# Altium schematic sheet RF frontend.SchDoc
size A3; SheetNumber: 2; SheetTotal: 3
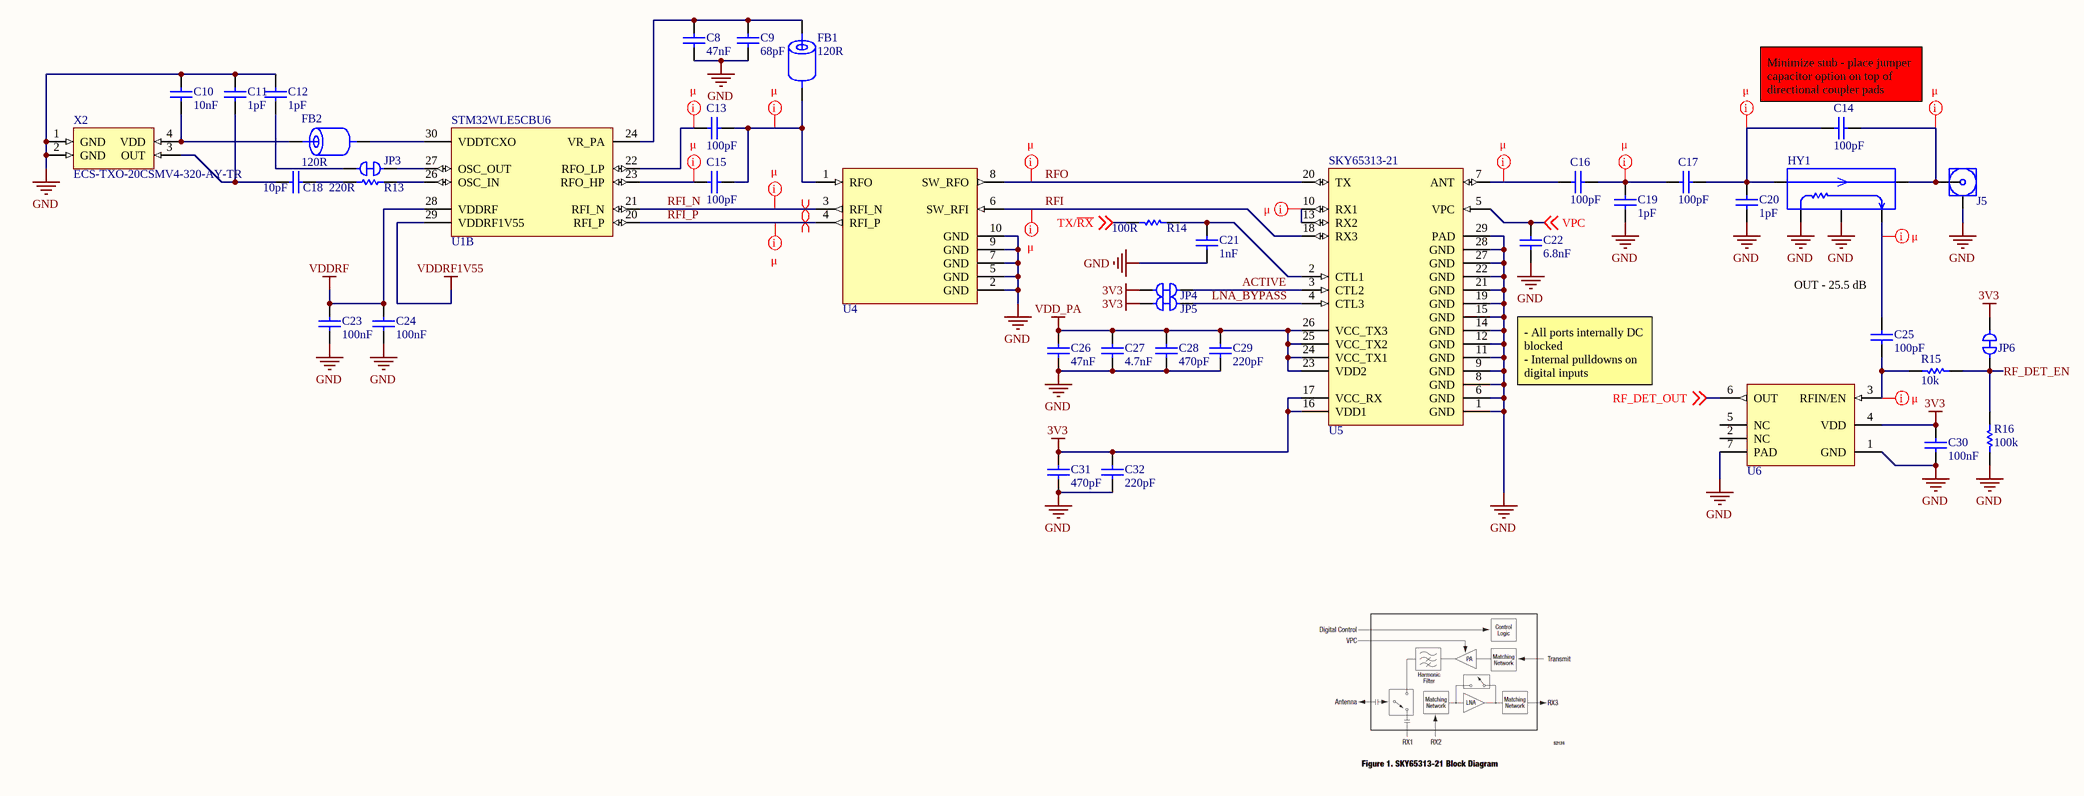
[diagram p0: RF frontend.SchDoc]

## Parts
C8  value 47nF  [CAPC1608X10N]  (hidden comment: CL10B473KB8NNNC)
C9  value 68pF  [CAPC1005X06N]  (hidden comment: CL05C680JB5NNNC)
C10  value 10nF  [CAPC1608X10N]  (hidden comment: C0603C103J5RACTU)
C11  value 1pF  [CAPC1608X10N]  (hidden comment: CC0603CRNPO0BN1R0)
C12  value 1pF  [CAPC1608X10N]  (hidden comment: CC0603CRNPO0BN1R0)
C13  value 100pF  [CAPC1005X05N]  (hidden comment: C0402C101J5GAC7411)
C14  value 100pF  [CAPC1005X05N]  (hidden comment: C0402C101J5GAC7411)
C15  value 100pF  [CAPC1005X05N]  (hidden comment: C0402C101J5GAC7411)
C16  value 100pF  [CAPC1005X05N]  (hidden comment: C0402C101J5GAC7411)
C17  value 100pF  [CAPC1005X05N]  (hidden comment: C0402C101J5GAC7411)
C18  value 10pF  [CAPC1608X10N]  (hidden comment: GRM1885C1H100JA01D)
C19  value 1pF  [CAPC1005X05N]  (hidden comment: GCM1555C1H1R0JA16D)
C20  value 1pF  [CAPC1005X05N]  (hidden comment: GCM1555C1H1R0JA16D)
C21  value 1nF  [CAPC1608X10N]  (hidden comment: C0603C102K5RAC)
C22  value 6.8nF  [CAPC1005X06N]  (hidden comment: 0402B682K500NT)
C23  value 100nF  [CAPC1608X10N]  (hidden comment: C0603C104M5RACTU)
C24  value 100nF  [CAPC1608X10N]  (hidden comment: C0603C104M5RACTU)
C25  value 100pF  [CAPC1005X05N]  (hidden comment: C0402C101J5GAC7411)
C26  value 47nF  [CAPC1608X10N]  (hidden comment: CL10B473KB8NNNC)
C27  value 4.7nF  [CAPC1608X10N]  (hidden comment: 0603B472K500NT)
C28  value 470pF  [CAPC1608X10N]  (hidden comment: C0603C471J1RACTU)
C29  value 220pF  [CAPC1608X10N]  (hidden comment: CL10B221KB8NNNC)
C30  value 100nF  [CAPC1608X10N]  (hidden comment: C0603C104M5RACTU)
C31  value 470pF  [CAPC1608X10N]  (hidden comment: C0603C471J1RACTU)
C32  value 220pF  [CAPC1608X10N]  (hidden comment: CL10B221KB8NNNC)
FB1  value 120R  [INDC1608X10N]  (hidden comment: PE-0603PFB121ST)
FB2  value 120R  [INDC1608X10N]  (hidden comment: PE-0603PFB121ST)
HY1  HHM22139A2  [SOTFL55P150X70-6N]  (value not drawn)
J5  EMPCB.SMAFSTJ.B.HT  [FP-EMPCB_SMAFSTJ_B_HT-MFG]  (value not drawn)
JP3  RC0603FR-070RL  [RESC1608X05N]  (value not drawn)
JP4  RC0603FR-070RL  [RESC1608X05N]  (value not drawn)
JP5  RC0603FR-070RL  [RESC1608X05N]  (value not drawn)
JP6  RC0603FR-070RL  [RESC1608X05N]  (value not drawn)
R13  value 220R  [RESC1005X04N]  (hidden comment: 0402WGF2200TCE)
R14  value 100R  [RESC1608X06N]  (hidden comment: CRCW0603100RFKEAC)
R15  value 10k  [RESC1608X06N]  (hidden comment: CRCW060310K0FKEA)
R16  value 100k  [RESC1608X05N]  (hidden comment: RC0603FR-07100KL)
U1  STM32WLE5CBU6  [QFN50P700X700X60_HS-49L]  (part B of 3)
U4  0900FM15K0039001E  [0900FM15K0039001E-Footprint-1]  (value not drawn)
U5  SKY65313-21  [QFN75P600X600X100_HS-25N]
U6  LMV228SD/NOPB  [NGF0006A_V]  (value not drawn)
X2  ECS-TXO-20CSMV4-320-AY-TR  [ECS-TXO-20CSMV4-320-AY-TR-Footprint-1]

## Nets
3V3: C30.2 C31.2 C32.2 JP4.1 JP5.1 JP6.2 U5.16(VDD1) U5.17(VCC_RX) U6.4(VDD)
GND: C8.1 C9.1 C10.2 C11.1 C12.1 C19.1 C20.1 C21.1 C22.1 C23.1 C24.1 C26.2 C27.2 C28.2 C29.2 C30.1 C31.1 C32.1 HY1.4(ISOLATED) HY1.5(GND) J5.2(GND) R16.1 U4.2(GND) U4.5(GND) U4.7(GND) U4.9(GND) U4.10(GND) U5.1(GND) U5.6(GND) U5.8(GND) U5.9(GND) U5.11(GND) U5.12(GND) U5.14(GND) U5.15(GND) U5.19(GND) U5.21(GND) U5.22(GND) U5.27(GND) U5.28(GND) U5.29(PAD) U6.1(GND) U6.7(PAD) X2.1(GND) X2.2(GND)
VDD_PA: C26.1 C27.1 C28.1 C29.1 U5.23(VDD2) U5.24(VCC_TX1) U5.25(VCC_TX2) U5.26(VCC_TX3)
VDDRF: C23.2 C24.2 U1.28(VDDRF)
VDDRF1V55: U1.29(VDDRF1V55)
ACTIVE: JP4.2 U5.3(CTL2)
LNA_BYPASS: JP5.2 U5.4(CTL3)
RF_DET_EN: JP6.1 R15.2 R16.2
RF_DET_OUT: U6.6(OUT) ; off-sheet RF_DET_OUT
RFI: U4.6(SW_RFI) U5.18(RX3)
RFI_N: U1.21(RFI_N) U4.3(RFI_N)
RFI_P: U1.20(RFI_P) U4.4(RFI_P)
RFO: U4.8(SW_RFO) U5.20(TX)
TX/~{RX}: R14.1 ; off-sheet TX/~{RX}
VPC: C22.2 U5.5(VPC) ; off-sheet VPC
NetC8_2: C8.2 C9.2 FB1.1 U1.24(VR_PA)
NetC10_1: C10.1 FB2.1 X2.4(VDD)
NetC11_2: C11.2 C18.1 X2.3(OUT)
NetC12_2: C12.2 JP3.2
NetC13_1: C13.1 C15.1 FB1.2 U4.1(RFO)
NetC13_2: C13.2 U1.22(RFO_LP)
NetC14_1: C14.1 HY1.2(TRANSMITTED) J5.1(SIG)
NetC14_2: C14.2 C17.1 C20.2 HY1.1(INPUT)
NetC15_2: C15.2 U1.23(RFO_HP)
NetC16_1: C16.1 C17.2 C19.2
NetC16_2: C16.2 U5.7(ANT)
NetC18_2: C18.2 R13.2
NetC21_2: C21.2 R14.2 U5.2(CTL1)
NetC25_1: C25.1 HY1.3(COUPLED)
NetC25_2: C25.2 R15.1 U6.3(RFIN/EN)
NetFB2_2: FB2.2 U1.30(VDDTCXO)
NetJP3_1: JP3.1 U1.27(OSC_OUT)
NetR13_1: R13.1 U1.26(OSC_IN)
NetU5_10: U5.10(RX1) U5.13(RX2)

Not connected (* = marked no-connect by the designer): U6 2(NC) 5(NC)

## Layout directives
net class microwave: NetC13_1, NetC13_2, NetC14_1, NetC14_2, NetC15_2, NetC16_1, NetC16_2, NetC25_1, NetC25_2, NetU5_10, RFI, RFI_N, RFI_P, RFO
differential pair: RFI_N, RFI_P

## Notes on the sheet
- (near C14) Minimize stub - place jumper capacitor option on top of directional coupler pads
- OUT - 25.5 dB
- - All ports internally DC blocked
  - Internal pulldowns on digital inputs
- Title:
- Designer:
- Date:
- Size:
- Revision:
- A3
- Sheet:
- !
- UWA Aerospace, 35 Stirling Hwy, Perth WA 6009, Australia

## Library data of the parts
C8 C26 = CMP-00130-2: Prices include import duty and tax. CAP, 0.047UF, 50V, MLCC, 0603; SVHC: No SVHC (15-Jan-2019); Material: Ceramic; Dielectric: Y5V; Tolerance: 10%; Case/Package: 0603; Radiation Hardening: No; Series: CL; Construction: Flat; Case Code (Metric): 1608; Voltage: 50V; Voltage Rating: 50V; Lead Free: Lead Free; Mounting Technology: Surface Mount; JLC_PN: C1622; Packaging: Tape and Reel; Length: 1.6mm; Depth: 0.8mm; Thickness: 0.035inch; Width: 0.031inch; Max Operating Temperature: 125°C; Package Quantity: 1; Min Operating Temperature: -55°C; Height: 0.8mm; RoHS Compliant: Yes; Case Code (Imperial): 0603; Voltage Rating (DC): 50V
C9 = CMP-00621-1: Ceramic capacitor SMD-0402 68pF /50V C0G# J +-5%, Samsung, RoHS; Voltage: 50V; Temperature Coefficient: 300ppm/°C; Dielectric: C0G; Tolerance: 5%; JLC_PN: C14441; Case/Package: 0402; Length: 1mm; Construction: Flat; Series: CL; Case Code (Imperial): 0402; Voltage Rating: 50V; Max Operating Temperature: 125°C; Min Operating Temperature: -55°C; Case Code (Metric): 1005; Height: 0.5mm; Radiation Hardening: No; Material: Ceramic; RoHS Compliant: Yes; Packaging: Tape and Reel; Lead Free: Lead Free; Voltage Rating (DC): 50V; Depth: 0.5mm; Mounting Technology: Surface Mount
C10 = CMP-00047-2: Cap Ceramic 0.01uF 50V X7R 5% SMD 0603 125C Paper T/R; Packaging: Tape and Reel; Min Operating Temperature: -55°C; Radiation Hardening: No; JLC_PN: C57112; Length: 1.6mm; Capacitance: 10nF; Depth: 0.8mm; Tolerance: 5%; Max Operating Temperature: 125°C; Case/Package: 0603; Height: 0.8mm; Dielectric: X7R; Mount: Surface Mount
C11 C12 = CMP-00536-1: 0603 1 pF 100 V ±0.25 pF Tolerance NP0 SMT Multilayer Ceramic Capacitor; Voltage Rating: 100V; Dielectric: C0G; Length: 0.063inch; Min Operating Temperature: -55°C; Lead Free: Lead Free; Mounting Technology: Surface Mount; Case/Package: 0603; Depth: 0.8mm; Width: 0.031inch; Height: 0.8mm; Case Code (Imperial): 0603; Weight: 7.1E-05oz; Construction: Flat; Voltage Rating (DC): 100V; Max Operating Temperature: 125°C; Series: CC; Resistor Type: Ceramic; Thickness: 0.035inch; Case Code (Metric): 1608; Termination: SMD/SMT; Radiation Hardening: No; Packaging: Tape and Reel
C13-C17 C25 = CMP-00082-3: Cap Ceramic 100pF 50V C0G 5% SMD 0402 125C Paper T/R; Case/Package: 0402; Voltage Rating (DC): 50V; JLC PN: C1546
C18 = CMP-00381-2: 0603 10pF 50V ±5 % Tolerance C0G SMT Multilayer Ceramic Capacitor; Insulation Resistance: 10GR; Temperature Coefficient: 30ppm/°C; Tolerance: 5%; Size: 0.8mm; Case Code (Metric): 1608; Max Operating Temperature: 125°C; REACH SVHC: No SVHC; Voltage Rating (DC): 50V; Construction: Flat; Min Operating Temperature: -55°C; RoHS Compliant: Yes; Radiation Hardening: No; Depth: 0.8mm; Thickness: 0.035inch; Series: GRM; Dielectric Material: Ceramic; Dielectric: C0G; Lead Free: Lead Free; Mount: Surface Mount; Length: 1.6mm; Case/Package: 0603; Termination: SMD/SMT; Package Quantity: 1; Number of Pins: 2; Capacitance: 10pF; Packaging: Tape and Reel; Height: 0.8mm; Case Code (Imperial): 0603; Voltage: 50V; Material: Ceramic; Voltage Rating: 50V; Width: 0.031inch; Mounting Technology: Surface Mount; JLC_PN: C1634
C19 C20 = CMP-00086-1: Cap Ceramic 1pF 50V C0G 5% Pad SMD 0402 125C Automotive T/R
C21 = CMP-002-000001-2: Cap Ceramic 0.001uF 50V X7R 10% SMD 0603 125°C Bulk; Dissipation Factor: 2.5%; Pin Count: 2; Lead Free: Lead Free; Capacitance: 1nF; Tolerance: 10%; Case/Package: 0603; Height: 0.8mm; Mounting Technology: Surface Mount; Width: 0.8mm; Packaging: Tape and Reel; Series: C0603C; Min Operating Temperature: -55°C; Package Quantity: 4000; Component Type: Standard; Length: 1.6mm; Source: BMS_LIB.SchLib; Voltage Rating: 50V; Voltage Rating (DC): 50V; Radiation Hardening: No; Construction: Flat; Thickness: 0.035inch; Termination: SMD/SMT; Voltage: 50V; Lead Pitch: 0.7mm; Max Operating Temperature: 125°C; Case Code (Metric): 1608; Case Code (Imperial): 0603; Design Item ID: C0603C102K5RAC; RoHS Compliant: Yes; Material: Ceramic; Dielectric: X7R; Depth: 0.8mm
C22 = CMP-00615-1: 50V 6.8nF X7R ±10% 0402 Multilayer Ceramic Capacitors MLCC - SMD/SMT ROHS; JLC_PN: C1542
C23 C24 C30 = CMP-00038-5: Cap Ceramic 0.1uF 50V X7R 20% SMD 0603 125C T/R; Dissipation Factor: 2.5%; Capacitance: 100nF; Contact Plating: Tin,Matte; Length: 1.6mm; Lead Pitch: 0.7mm; Thickness: 0.034inch; Max Operating Temperature: 125°C; Voltage Rating: 50V; Termination: SMD/SMT; Depth: 0.8mm; REACH SVHC: No SVHC; Radiation Hardening: No; Case Code (Metric): 1608; Mount: Surface Mount,PCB; Package Quantity: 1; Case Code (Imperial): 0603; Width: 0.031inch; JLC_PN: C14663; Min Operating Temperature: -55°C; Packaging: Tape and Reel; Case/Package: 0603; Tolerance: 20%; Dielectric Material: Ceramic; Height: 0.8mm; Dielectric: X7R; Voltage Rating (DC): 50V
C27 = CMP-00614-1: 50V 4.7nF X7R ±10% 0603  Multilayer Ceramic Capacitors MLCC - SMD/SMT ROHS; JLC_PN: C53987
C28 C31 = CMP-00313-1: Cap Ceramic 470pF 100V X7R 5% SMD 0603 125°C Paper T/R; Termination: SMD/SMT; Width: 0.031inch; Mount: Surface Mount; Case Code (Imperial): 0603; Weight: 7.1E-05oz; Packaging: Tape and Reel; Voltage Rating: 100V; Depth: 0.8mm; Max Operating Temperature: 125°C; Min Operating Temperature: -55°C; Thickness: 0.034inch; RoHS Compliant: Yes; Case/Package: 0603; Construction: Flat; Tolerance: 5%; Length: 1.6mm; Dielectric: X7R; Radiation Hardening: No; Capacitance: 470pF; Case Code (Metric): 1608; REACH SVHC: No SVHC; Series: C; Package Quantity: 4000; Voltage Rating (DC): 100V; Dielectric Material: Ceramic; Height: 0.8mm
C29 C32 = CMP-00612-1: CAP CER 220PF 50V X7R 0603; Tolerance: 10%; Material: Ceramic; Case Code (Imperial): 0603; Height: 0.8mm; Mounting Technology: Surface Mount; Max Operating Temperature: 125°C; Length: 1.6mm; Min Operating Temperature: -55°C; Construction: Flat; Thickness: 0.035inch; Packaging: Tape and Reel; Voltage Rating: 50V; RoHS Compliant: Yes; Voltage: 50V; Dielectric: X7R; Series: CL; Width: 0.031inch; JLC_PN: C1603; Case/Package: 0603; Case Code (Metric): 1608; Radiation Hardening: No; Depth: 0.8mm
FB1 FB2 = CMP-00562-1: Ferrite Beads Multi-Layer High Current 120Ohm 25% 100MHz 2A 0.05Ohm DCR 0603 T/R; DC Resistance (DCR): 50mR; Number of Lines: 1; Max Current Rating: 2A; Packaging: Cut Tape; Height: 0.041inch; Case Code (Metric): 1608; Min Operating Temperature: -40°C; Case/Package: 0603; Series: PFB; Length: 0.063inch; Case Code (Imperial): 0603; Max Operating Temperature: 105°C; Mounting Technology: Surface Mount; Package Quantity: 4000; Width: 0.031inch
HY1 = CMP-00629-1: Multilayer Directional Coupler for 698MHz to 2620MHz 6-Pin SMD; pin to pad: 2>3 3>6 5>2+5; Return Loss: 29dB; Insertion Loss: 0.11dB; Case Code (Metric): 1608; Case/Package: 0603; Series: HHM; RoHS Compliant: Yes; Case Code (Imperial): 0603; Packaging: Cut Tape; Frequency: 698MHz
J5 = CMP-00377-4: SMA Connector Jack, Female Socket 50 Ohm Board Edge, End Launch Solder; pin to pad: 2>2+3; Frequency: 12.4GHz; Voltage Rating: 335V; Plating: Gold; Insulation Resistance: 5GR; Number of Ports: 1; Dielectric Material: PTFE; Impedance: 50R; Polarity: Standard; Body Material: Brass; Mount: Edge,Board; Contact Material: Brass; Case/Package: SMA; Contact Plating: Gold; Package Quantity: 100; Termination: Solder; Weight: 0.070548oz; Housing Color: Gold; Body Plating: Gold; Fastening Type: Threaded; Max Frequency: 12.4GHz; Center Contact Plating: Gold; Connector Type: SMA; Orientation: Straight; Packaging: Tray; Series: -
JP3-JP6 = CMP-00415-4: RC Series 0603 0.1 W 0 Ohm Jumper Surface Mount Thick Film Chip Resistor; Voltage Rating: 50V; Temperature Coefficient: 200ppm/°C; Max Power Dissipation: 100mW; Tolerance: 1%; Resistance: 0mR; Working Voltage: 75V; Current Rating: 1A; Radiation Hardening: No; Case Code (Metric): 1608; Military Standard: Not; Max Operating Temperature: 155°C; Power Rating: 100mW; Features: Moisture Resistant; Length: 1.6mm; RoHS Compliant: Yes; Series: RC; Termination: SMD/SMT; Package Quantity: 5000; REACH SVHC: No SVHC; Contact Plating: Tin,Matte; Height: 0.45mm; Resistor Type: Thick Film; Construction: Rectangular; Case Code (Imperial): 0603; Case/Package: 0603; JLC_PN: C21189; Technology: THICK FILM; Packaging: Tape and Reel; Voltage Rating (DC): 50V; Depth: 0.8mm; Number of Terminations: 2; Lead Free: Lead Free; Resistance Tolerance: 1%; Number of Pins: 2; Width: 0.8mm; Min Operating Temperature: -55°C
R13 = CMP-00611-1: Res Thick Film 0402 220 Ohm 5% 1/16W ±100ppm/°C Molded SMD SMD Paper T/R; Min Operating Temperature: -55°C; Max Operating Temperature: 155°C; Contact Plating: Tin,Matte; RoHS Compliant: Yes; JLC_PN: C25091; Case/Package: 0402; Tolerance: 5%; Temperature Coefficient: 100ppm/°C
R14 = CMP-00040-1: RES SMD 100 OHM 1% 1/10W 0603; Power Rating: 100mW; Lead Free: Lead Free; Resistance: 100R; Case/Package: 0603; Tolerance: 1%
R15 = CMP-00042-5: VISHAY - CRCW060310K0FKEA - SMD Chip Resistor, 0603 [1608 Metric], 10 kohm, CRCW e3 Series, 75 V, Thick Film, 100 mW; Voltage Rating (DC): 75V; Max Power Dissipation: 100mW; Resistance: 10kR; Tolerance: 1%; Temperature Coefficient: 100ppm/°C; Height: 0.45mm; Radiation Hardening: No; Voltage Rating: 75V; Case/Package: 0603; Max Operating Temperature: 155°C; Termination: SMD/SMT; Number of Pins: 2; Width: 0.033inch; Case Code (Metric): 1608; Power Rating: 100mW; JLC_PN: C25804; Packaging: Tape and Reel; Package Quantity: 10; Military Standard: Not; Number of Terminations: 2; Weight: 7.1E-05oz; Composition: Thick Film; Length: 1.55mm; Features: Automotive AEC-Q200; Min Operating Temperature: -55°C; Lead Free: Lead Free; Contact Plating: Tin,Lead; Case Code (Imperial): 0603; REACH SVHC: Unknown; Depth: 0.85mm
R16 = CMP-00345-2: RES SMD 100K OHM 1% 1/10W 0603; Max Power Dissipation: 100mW; Resistance: 100kR; Voltage Rating (DC): 50V; Temperature Coefficient: 100ppm/°C; Working Voltage: 75V; Termination: SMD/SMT; Case Code (Metric): 1608; Height: 0.45mm; Reach SVHC Compliant: No; JLC_PN: C25803; Case Code (Imperial): 0603; Case/Package: 0603; Power Rating: 100mW; Lead Free: Lead Free; Voltage Rating: 50V; Min Operating Temperature: -55°C; Width: 0.8mm; Technology: THICK FILM; Tolerance: 1%; Max Operating Temperature: 155°C; Number of Pins: 2; Pins: 2; Features: Moisture Resistant; Number of Terminations: 2; Construction: Rectangular; Series: RC; Military Standard: Not; Resistor Type: Thick Film; Resistance Tolerance: 1%; REACH SVHC: No SVHC; Depth: 0.8mm; Packaging: Tape and Reel; RoHS Compliant: Yes; Length: 1.6mm
U1 = CMP-00608-3: Microcontroller 32-Bit Arm Cortex-M4 RISC 128Kbyte 1.8V to 3.6V 48-Pin UFQFPN Industrial; Core:: ARM Cortex M4; Number of I/Os:: 43 I/O; Tradename:: STM32; Program Memory Size:: 128 kB; ADC Resolution:: 12 bit; Data Bus Width:: 32 bit; Package / Case:: UFQFPN-48; Product Category:: RF Microcontrollers - MCU; Mounting Style:: SMD/SMT; Brand:: STMicroelectronics; Interface Type:: I2C; Packaging:: Tray; Subcategory:: Wireless & RF Integrated Circuits; Data RAM Type:: RAM; Technology:: Si; Data RAM Size:: 64 kB; Maximum Clock Frequency:: 48 MHz; Program Memory Type:: Flash; Supply Voltage - Max:: 3.6 V; Series:: STM32WL; Minimum Operating Temperature:: - 40 C; Operating Supply Voltage:: 1.8 V to 3.6 V; Product Type:: RF Microcontrollers - MCU; Maximum Operating Temperature:: + 105 C; Supply Voltage - Min:: 1.8 V; Manufacturer:: STMicroelectronics; Moisture Sensitive:: Yes
U4 = CMP-00620-1: Semtech SX1261 SX1262 Balun Filt; Manufacturer:: Johanson; Brand:: Johanson Technology; Mounting:: PCB Mount; Insertion Loss:: 1.4 dB; Product:: Filters; Product Type:: Signal Conditioning; Frequency:: 900 MHz; Frequency Range:: 862 MHz to 928 MHz; Voltage Rating:: 5 V; Impedance:: 50 Ohms; Type:: Impedance-Matched Filter; Maximum Operating Temperature:: + 85 C; Minimum Operating Temperature:: - 40 C; Product Category:: Signal Conditioning; Termination Style:: SMD/SMT; Subcategory:: Filters
U5 = CMP-00070-3: Skyworks 900 MHz front end module 30.5 dBm; Frequency: 930MHz; Case/Package: SMD/SMT; Packaging: Tape and Reel; Series: -; RoHS Compliant: Yes
U6 = CMP-00630-1: RF Detector 450MHz to 2000MHz 15dBm 6-Pin WSON EP T/R; Operating Supply Voltage: 5V; Operating Supply Current: 8mA; Width: 2.2mm; Radiation Hardening: No; Length: 2.5mm; Lead Free: Lead Free; Package Quantity: 1000; Series: LMV228; Thickness: 800um; Frequency: 450MHz; Pins: 6; RoHS Compliant: Yes; Packaging: Tape and Reel
X2 = CMP-00610-2: Xtal Osc Tcxo 32.0000MHZ Clpsw 10 pF 0.5 ppm; Manufacturer:: ECS; Output Format:: Clipped Sine Wave; Frequency:: 32 MHz; Mounting Style:: SMD/SMT; Supply Voltage - Max:: 3.6 VDC; Frequency Stability:: 0.5 PPM; Current Rating:: 2 mA; Subcategory:: Oscillators; Operating Supply Voltage:: 1.8 V, 2.5 V, 3.3 V; Product Category:: TCXO Oscillators; Package/Case:: 2 mm x 1.6 mm x 0.8 mm; Supply Voltage - Min:: 1.7 VDC; Load Capacitance:: 10 pF; Width:: 1.6 mm; Product Type:: TCXO; Minimum Operating Temperature:: - 30 C; Length:: 2 mm; Height:: 0.8 mm; Maximum Operating Temperature:: + 85 C; Termination Style:: SMD/SMT; Brand:: ECS